# Altium schematic sheet 07.Mechanical.SchDoc
size A4; DocumentNumber: 08; SheetNumber: 8; SheetTotal: 8; Page: Mechanical parts
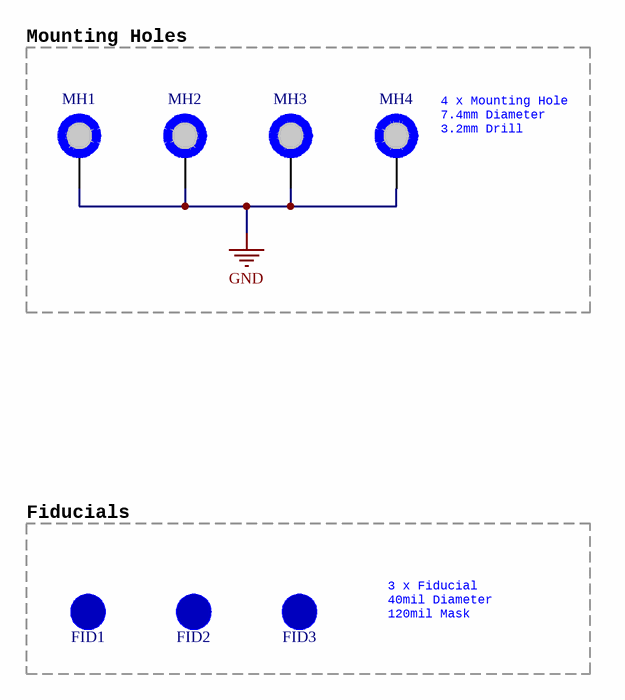
[diagram p0: 07.Mechanical.SchDoc]

## Parts
FID1  FID_1MMC  [FID_40X120D]  (value not drawn)  (no BOM)
FID2  FID_1MMC  [FID_40X120D]  (value not drawn)  (no BOM)
FID3  FID_1MMC  [FID_40X120D]  (value not drawn)  (no BOM)
MH1  MH_7.4MMC_3.2MMD  [MH_7.4MMD_3.2MMD_VIA_SUPPORT]  (value not drawn)  (no BOM)
MH2  MH_7.4MMC_3.2MMD  [MH_7.4MMD_3.2MMD_VIA_SUPPORT]  (value not drawn)  (no BOM)
MH3  MH_7.4MMC_3.2MMD  [MH_7.4MMD_3.2MMD_VIA_SUPPORT]  (value not drawn)  (no BOM)
MH4  MH_7.4MMC_3.2MMD  [MH_7.4MMD_3.2MMD_VIA_SUPPORT]  (value not drawn)  (no BOM)

## Blocks framed on the sheet
Mounting Holes: MH1-MH4
Fiducials: FID1-FID3

## Nets
GND: MH1.1 MH2.1 MH3.1 MH4.1

## Notes on the sheet
- (near MH4) 4 x Mounting Hole
  7.4mm Diameter
  3.2mm Drill
- 3 x Fiducial 40mil Diameter 120mil Mask
- Title :
- Size:
- Date:
- Page :
- A4
- Number:
- Time:
- Revision:
- Sheet
- of
- Sheet Name :
- Drawn By :

## Library data of the parts
FID1-FID3 = FID_1MMC: Fiducial 40mil Diameter, 120mil Mask; Supplier: Digikey
MH1-MH4 = MH_7.4MMC_3.2MMD: Mounting Hole 7.4mm Diameter, 3.2mm Drill